# EAGLE schematic p2-001 (EAGLE 9.5.2)
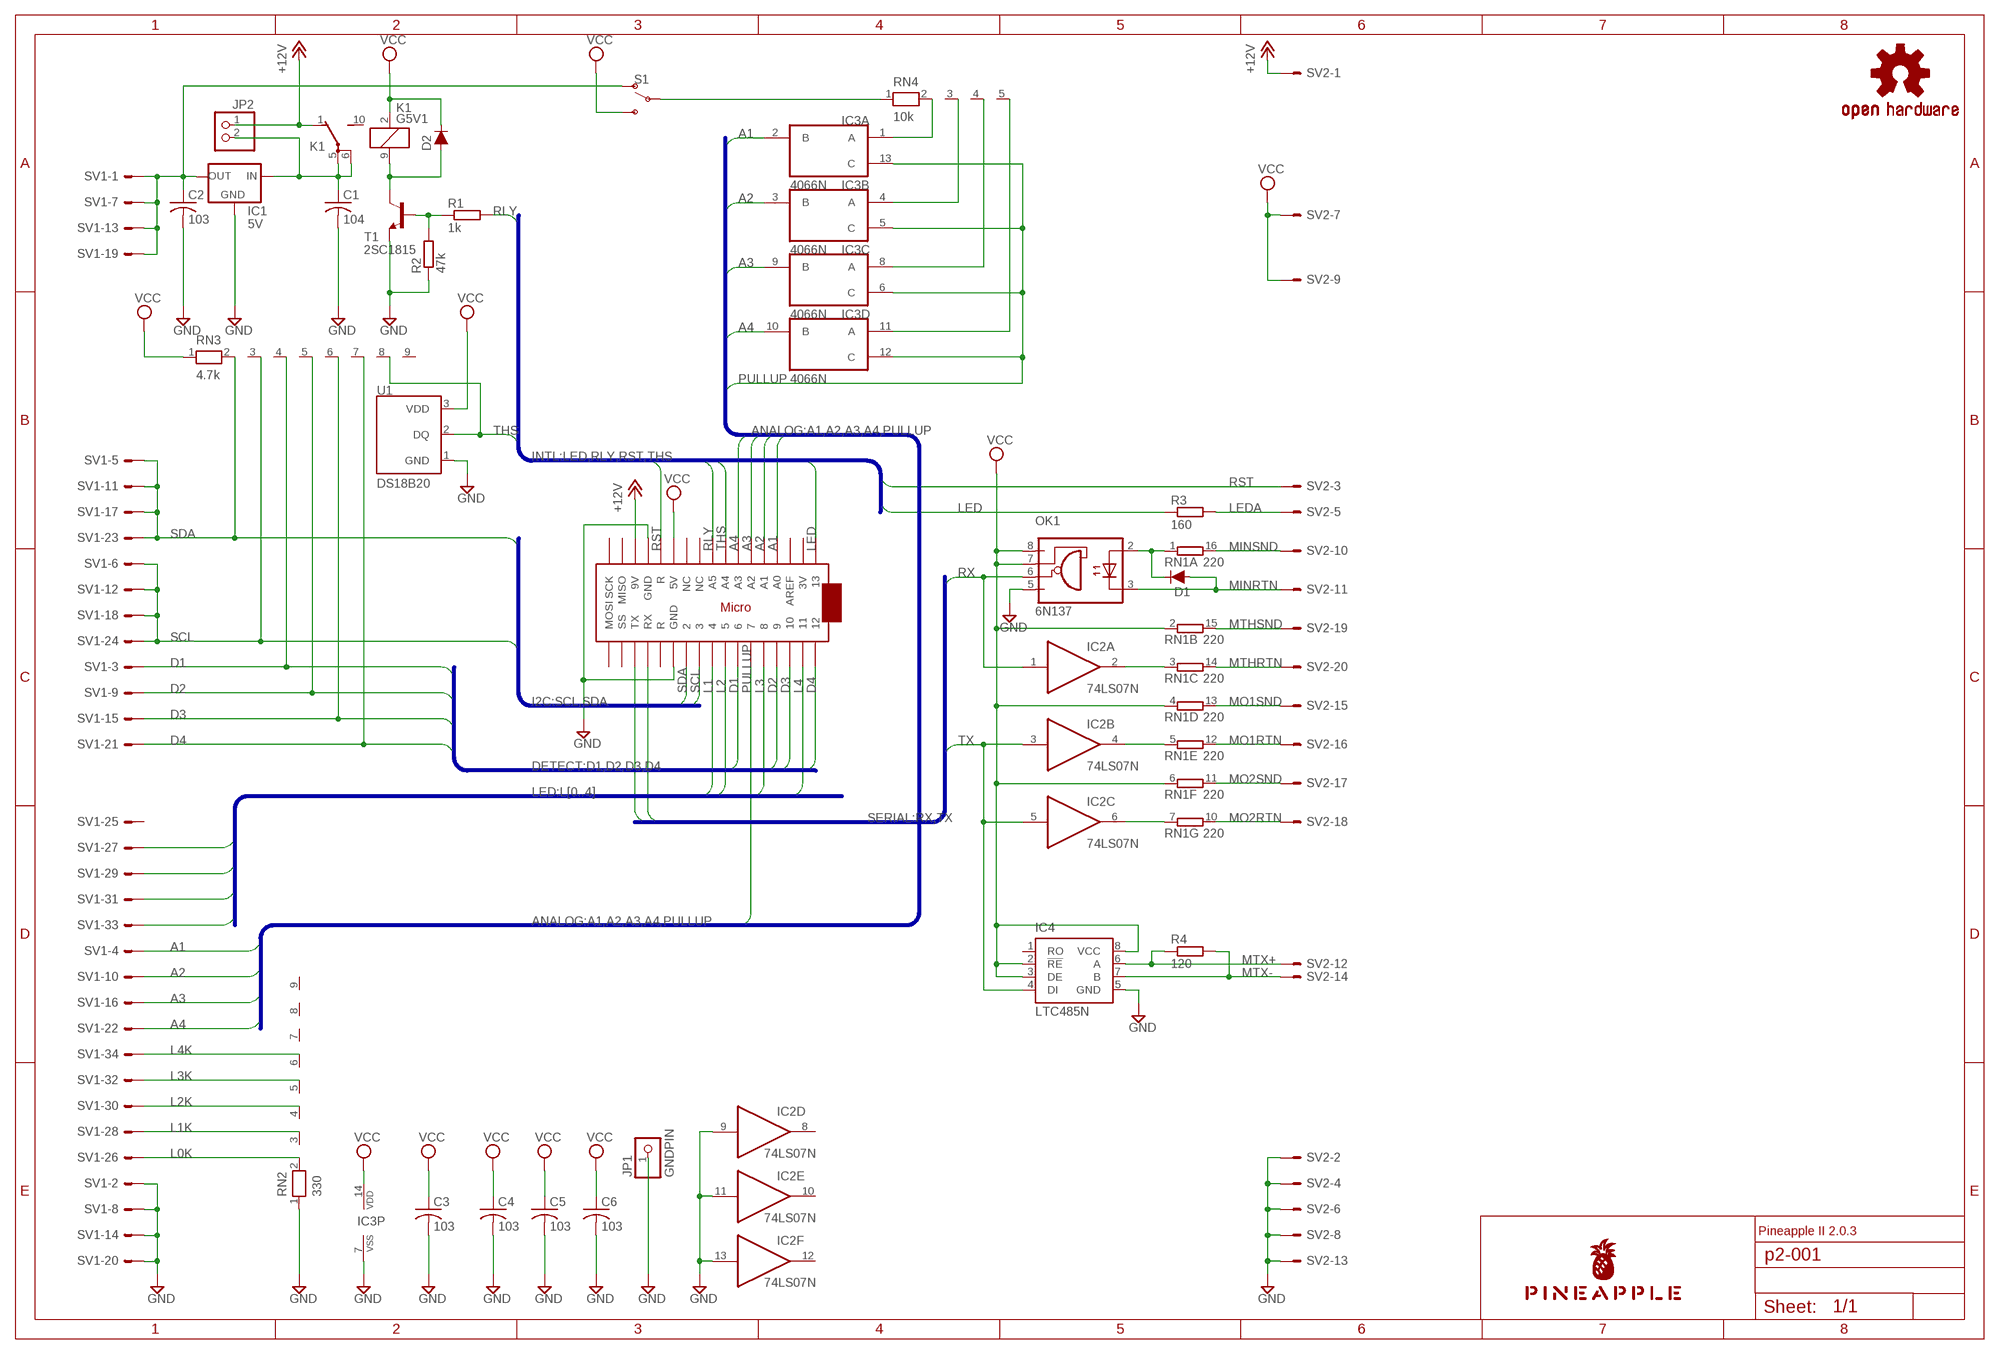
[diagram p0: schematic, sheet 1]

## Parts
C1  104  C-US025-025X050  [C025-025X050]
C2  103  C-US025-025X050  [C025-025X050]
C3  103  C-US025-025X050  [C025-025X050]
C4  103  C-US025-025X050  [C025-025X050]
C5  103  C-US025-025X050  [C025-025X050]
C6  103  C-US025-025X050  [C025-025X050]
D1  DIODE-1N4148  [DIODE-1N4148]
D2  DIODE-1N4148  [DIODE-1N4148]
IC1  5V  78XXL  [78XXL]
IC2  74LS07N  [DIL14]
IC3  4066N  [DIL14]
IC4  LTC485N  [DIL08]
JP1  GNDPIN  PINHD-1X1  [1X01]
JP2  PINHD-1X2  [1X02]
K1  G5V1  [G5V1]
LOGO1  OSHW-LOGOS-COPPER  [OSHW-LOGO-S_COPPER]
MC1  ARDUINOMICRO  [ARDUINOMICRO]
OK1  6N137  [DIL08]
R1  1k  R-EU_0204/5  [0204/5]
R2  47k  R-EU_0204/5  [0204/5]
R3  160  R-EU_0204/5  [0204/5]
R4  120  R-EU_0204/5  [0204/5]
RN1  220  8R-N  [DIL16]
RN2  330  RN08  [RN-9]
RN3  4.7k  RN08  [RN-9]
RN4  10k  RN04  [RN-5]
S1  SWITCH-SPDT-PTH-11.6X4.0MM  [SWITCH_SPDT_PTH_11.6X4.0MM]
SV1  ML34LE  [ML34L]
SV2  ML20LE  [ML20L]
T1  2SC1815  [TO92-ECB]
U1  DS18B20  [TO-92-AMMO]
U$1  PINEAPPLE450_SILK  [PINEAPPLE450_SILK]

## Nets
A1 [analog]: IC3.2(A:B) MC1.P$31(A0) SV1.4
A2 [analog]: IC3.3(B:B) MC1.P$30(A1) SV1.10
A3 [analog]: IC3.9(C:B) MC1.P$29(A2) SV1.16
A4 [analog]: IC3.10(D:B) MC1.P$28(A3) SV1.22
D1: MC1.P$7 RN3.4 SV1.3
D2: MC1.P$4 RN3.5 SV1.9
D3: MC1.P$3 RN3.6 SV1.15
D4: MC1.P$1 RN3.7 SV1.21
GND [gnd]: C1.2 C2.2 C3.2 C4.2 C5.2 C6.2 IC1.GND IC2.9(D:I) IC2.11(E:I) IC2.13(F:I) IC3.7(P:VSS) IC4.5(GND) JP1.1 MC1.P$12(GND) MC1.P$21(GND) OK1.5(GND) R2.1 RN2.1 SV1.2 SV1.8 SV1.14 SV1.20 SV2.2 SV2.4 SV2.6 SV2.8 SV2.13 T1.E U1.1(GND)
L0K: RN2.2 SV1.26
L1: MC1.P$9 SV1.27
L1K: RN2.3 SV1.28
L2: MC1.P$8 SV1.29
L2K: RN2.4 SV1.30
L3: MC1.P$5 SV1.31
L3K: RN2.5 SV1.32
L4: MC1.P$2 SV1.33
L4K: RN2.6 SV1.34
LED: MC1.P$34 R3.1
LEDA: R3.2 SV2.5
MIDIINSND: D1.C OK1.2(A) RN1.1
MIDIOUT2RTN: IC2.6(C:O) RN1.7
MIDIOUTRTN: IC2.4(B:O) RN1.5
MIDITHRURTN: IC2.2(A:O) RN1.3
MINRTN: D1.A OK1.3(C) SV2.11
MINSND: RN1.16 SV2.10
MO1RTN: RN1.12 SV2.16
MO1SND: RN1.13 SV2.15
MO2RTN: RN1.10 SV2.18
MO2SND: RN1.11 SV2.17
MTHRTN: RN1.14 SV2.20
MTHSND: RN1.15 SV2.19
MTX+: IC4.6(A) R4.1 SV2.12
MTX-: IC4.7(B) R4.2 SV2.14
N$3: IC3.1(A:A) RN4.2
N$4: IC3.4(B:A) RN4.3
N$5: IC3.8(C:A) RN4.4
N$6: IC3.11(D:A) RN4.5
PULLUP: IC3.5(B:C) IC3.6(C:C) IC3.12(D:C) IC3.13(A:C) MC1.P$6
RLY: MC1.P$26(A5) R1.2
RLYDRV: R1.1 R2.2 T1.B
RLYSNK: D2.A K1.9 T1.C
RST: MC1.P$13(R) SV2.3
RX: IC2.1(A:I) MC1.P$14(RX) OK1.6(VO)
SCL: MC1.P$10 RN3.3 SV1.6 SV1.12 SV1.18 SV1.24
SDA: MC1.P$11 RN3.2 SV1.5 SV1.11 SV1.17 SV1.23
THS: MC1.P$27(A4) RN3.8 U1.2(DQ)
TX: IC2.3(B:I) IC2.5(C:I) IC4.4(DI) MC1.P$15(TX)
V+12V [power]: C1.1 IC1.IN JP2.2 K1.5(2:P) K1.6(2:P)
VCC [power]: C3.1 C4.1 C5.1 C6.1 D2.C IC3.14(P:VDD) IC4.2(!RE) IC4.3(DE) IC4.8(VCC) K1.2 MC1.P$23(5V) OK1.7(VE) OK1.8(VCC) RN1.2 RN1.4 RN1.6 RN3.1 S1.3(S) SV2.7 SV2.9 U1.3(VDD)
VIN [power]: JP2.1 K1.1(2:O) MC1.P$20(9V) SV2.1 ; supply symbol labelled +12V
VOUT [power]: C2.1 IC1.OUT S1.1(O) SV1.1 SV1.7 SV1.13 SV1.19
VPULLUP [power]: RN4.1 S1.2(P)
Unconnected: IC2.8(D:O) IC2.10(E:O) IC2.12(F:O) IC4.1(RO) K1.10(2:S) MC1.P$16(SS) MC1.P$17(MOSI) MC1.P$18(SCK) MC1.P$19(MISO) MC1.P$22(R) MC1.P$24(NC) MC1.P$25(NC) MC1.P$32(AREF) MC1.P$33(3V) RN1.8 RN1.9 RN2.7 RN2.8 RN2.9 RN3.9 SV1.25

## Buses
I2C:SCL,SDA
LED:L[0..4]
ANALOG:A1,A2,A3,A4,PULLUP
DETECT:D1,D2,D3,D4
INTL:LED,RLY,RST,THS
SERIAL:RX,TX

## Notes on the sheet
- Pineapple II 2.0.3

## Power pins joined to a net without a drawn wire
GND: IC2.7(P:GND)
VCC: IC2.14(P:VCC)

## Library data of the parts
C1-C6 = rcl:C-US: CAPACITOR, American symbol
D1 D2 = SparkFun-DiscreteSemi:DIODE: Diode These are standard reverse protection diodes and small signal diodes. SparkFun Products: SparkFun SparkPunk Sound Kit <https://www.sparkfun.com/products/11177> SparkFun ESP8266 Thing <https://www.sparkfun.com/products/13231>; PROD_ID: DIO-08378; VALUE: 200mA/100V/1V
IC1 = v-reg:78XXL: VOLTAGE REGULATOR
IC2 = 74xx-us:74*07: Hex BUFFER, open collector high-voltage output
IC3 = 40xx:4066: Quad bilateral ANALOG SWITCH
IC4 = linear-technology:LTC485: Low Power RS485 Interface Transceiver Source: http://www.linear.com/pc/downloadDocument.do?navId=H0,C1,C1007,C1017,P2064,D1718; OC_FARNELL: unknown; OC_NEWARK: unknown
JP1 = pinhead:PINHD-1X1: PIN HEADER
JP2 = pinhead:PINHD-1X2: PIN HEADER
K1 = relay:G5V1: RELAY 1 x switch, 0.5 A/125 V AC, 1 A/24 V DC , Omron; MPN: G5V-1-DC24; OC_FARNELL: 9949593; OC_NEWARK: 36M6377
LOGO1 = SparkFun-Aesthetics:OSHW-LOGO: Open-Source Hardware (OSHW) Logo This logo indicates the piece of hardware it is found on incorporates a OSHW license and/or adheres to the definition of open source hardware found here: http://freedomdefined.org/OSHW
MC1 = adafruit:ARDUINOMICRO
OK1 = optocoupler:6N137: MOTOROLA OPTO COUPLER; MPN: 6N137; OC_FARNELL: 1328376; OC_NEWARK: 52M1895
R1-R4 = resistor:R-EU_: RESISTOR, European symbol
RN1 = resistor-dil:8R-N: DIL RESISTOR; OC_FARNELL: unknown; OC_NEWARK: unknown
RN2 RN3 = resistor-net:RN08: RESISTOR NETWORK; OC_FARNELL: unknown; OC_NEWARK: unknown
RN4 = resistor-net:RN04: RESISTOR NETWORK; OC_FARNELL: unknown; OC_NEWARK: unknown
S1 = SparkFun-Switches:SWITCH-SPDT: Single Pole, Double Throw (SPDT) Switch Single-pole, double-throw (SPDT) switch. Variant Overview SMD-AYZ0202 Surface Mount DPDT Switch <https://www.sparkfun.com/products/597> (COM-00597) Used on e.g. LilyPad Arduino USB - ATmega32U4 Board <https://www.sparkfun.com/products/12049> PTH-11.6X4.0MM SPDT Mini Power Switch <https://www.sparkfun.com/products/102> (COM-00102) Used on e.g. SparkFun Simon Says - Through-Hole Soldering Kit <https://www.sparkfun.com/products/10547> (KIT-10547) PTH-11.6X4.0MM-KIT KIT version of SPDT Mini Power Switch - Simplifies soldering by removing tStop of switch pins - only one side can be soldered. PTH-11.6X4.0MM-LOCK LOCK version of SPDT Mini Power Switch - Offset pins hold switch in place for easier soldering. SMD-RIGHT-ANGLE Surface Mount Right Angle Switch <https://www.sparkfun.com/products/10860> (COM-10860) Used on e.g. SparkFun ESP8266 Thing <https://www.sparkfun.com/products/13231>; PROD_ID: SWCH-08261; SF_SKU: COM-00102
SV1 = con-ml:ML34LE: HARTING; OC_FARNELL: unknown; OC_NEWARK: unknown
SV2 = con-ml:ML20LE: HARTING; OC_FARNELL: unknown; OC_NEWARK: unknown
T1 = transistor:2SC1815: NPN EPITAXIAL TRANSISTOR Source: TOSHIBA .. 2SC1815 1.pdf
U1 = SparkFun-Sensors:DS18B20: Dallas/Maxim DS18B20 1-Wire Temperature Sensor The DS18B20 reports degrees C with 9 to 12-bit precision, -55C to 125C (+/-0.5C). Each sensor has a unique 64-Bit Serial number etched into it - allows for a huge number of sensors to be used on one data bus. Datasheet <http://datasheets.maximintegrated.com/en/ds/DS18B20.pdf> SparkFun Products One Wire Digital Temperature Sensor - DS18B20 <https://www.sparkfun.com/products/245> (SEN-00245); STORE_ID: SEN-00245
U$1 = pineapple:PINEAPPLE450_SILK

## Net classes
0 default: width 0.152 mm, drill 0.152 mm, clearance 0.152 mm
1 gnd: width 0.61 mm, drill 0.152 mm, clearance 0.152 mm
2 power: width 0.61 mm, drill 0.152 mm, clearance 0.152 mm
3 analog: width 0.305 mm, drill 0.152 mm, clearance 0.152 mm